# Altium schematic sheet TCA785-W.SchDoc
size A; SheetNumber: 3; SheetTotal: 4
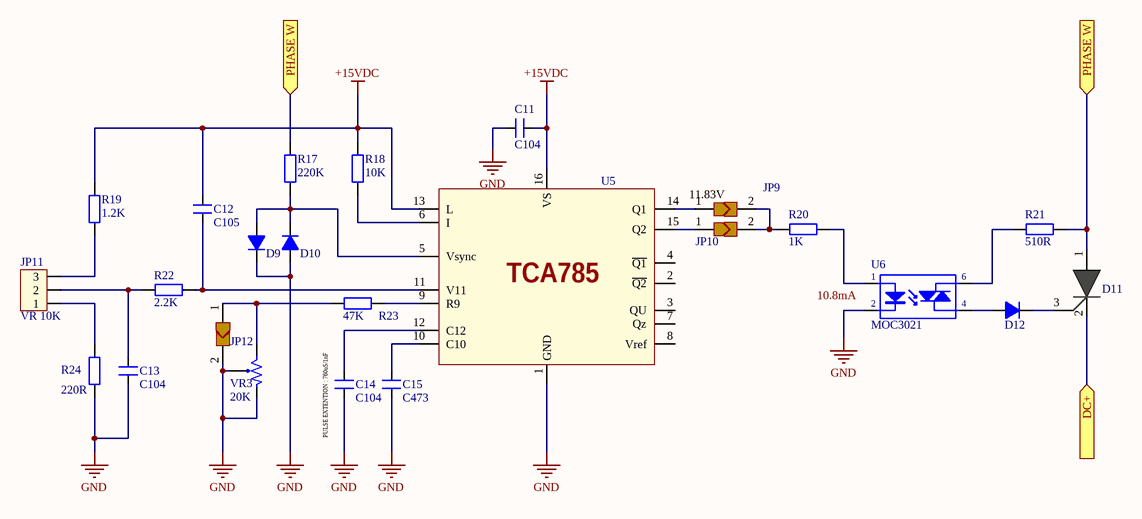
[diagram p0: TCA785-W.SchDoc]

## Parts
C11  C104  [CN2-O]
C12  C105  [CN2-O]
C13  C104  [CN2-O]
C14  C104  [CN2-O]
C15  C473  [CN2-O]
D9  Diode  1N4007  [DO41-1A]  (value not drawn)
D10  Diode  1N4007  [DO41-1A]  (value not drawn)
D11  SCR  [TO-220]  (value not drawn)
D12  Diode  1N4007  [DO41-1A]  (value not drawn)
JP9  PAD_Sellect  [PAD Select]  (value not drawn)
JP10  PAD_Sellect  [PAD Select]  (value not drawn)
JP11  VR 10K  [CON3]
JP12  PAD_Sellect  [PAD Select]  (value not drawn)
R17  220K  [R1/4W]
R18  10K  [R1/4W]
R19  1.2K  [R1/4W]
R20  1K  [R1/4W]
R21  510R  [R1/4W]
R22  2.2K  [R1/4W]
R23  47K  [R1/4W]
R24  220R  [R1/4W]
U5  TCA785Q  [DIP-16]  (value not drawn)
U6  MOC3021  [DIP6/W0.3 - MOC3021]
VR3  20K  [VR]

## Ports
DC+ (in), PHASE W (in)

## Nets
+15VDC: C11.2 C12.2 R18.1 R19.2 U5.13(L) U5.16(VS)
GND: C11.1 C13.1 C14.1 C15.1 D9.2 D10.1 JP12.2 R24.1 U5.1(GND) U6.2(K) VR3.1 VR3.2
DC+: D11.2(K) ; port DC+
PHASE W: D11.1(A) R17.1 R21.1 ; port PHASE W
NetC12_1: C12.1 R22.1 U5.11(V11)
NetC13_2: C13.2 JP11.2 R22.2
NetC14_2: C14.2 U5.12(C12)
NetC15_2: C15.2 U5.10(C10)
NetD9_1: D9.1 D10.2 R17.2 U5.5(Vsync)
NetD11_3: D11.3(G) D12.2
NetD12_1: D12.1 U6.4(E)
NetJP9_1: JP9.1 U5.14(Q1)
NetJP9_2: JP9.2 JP10.2 R20.2
NetJP10_1: JP10.1 U5.15(Q2)
NetJP11_1: JP11.1 R24.2
NetJP11_3: JP11.3 R19.1
NetJP12_1: JP12.1 R23.1 VR3.3
NetR18_2: R18.2 U5.6(I)
NetR20_1: R20.1 U6.1(A)
NetR21_2: R21.2 U6.6(C)
NetR23_2: R23.2 U5.9(R9)

Not connected (* = marked no-connect by the designer): U5 2(~{Q2}) 3(QU) 4(~{Q1}) 7(Qz) 8(Vref)

## Notes on the sheet
- (near JP9) 11.83V
- (near C14) PULSE EXTENTION : 760uS/1nF
- Labels drawn without touching a wire or pin: 10.8mA
- (in symbol TCA785Q) TCA785

## Library data of the parts
C11-C15 = CAP-gom: Value: 33pF
D9 D10 D12 = Diode  1N4007: Diode 1A; Value: 1N4007
D11 = BT151
JP11 = Con3: Connector 3; Value: Connector 3
R17-R24 = R1/4W: Resistor 1/4W; Value: R1/4W - 1K
U6 = MOC3021: Single Opto; Value: MOC3021
VR3 = VR: Var Resistor RM065; RM065-104: 10K; RM065-503: 5K; RM065-103: 1K